# Altium project nrf52805_caaa.PrjPCB
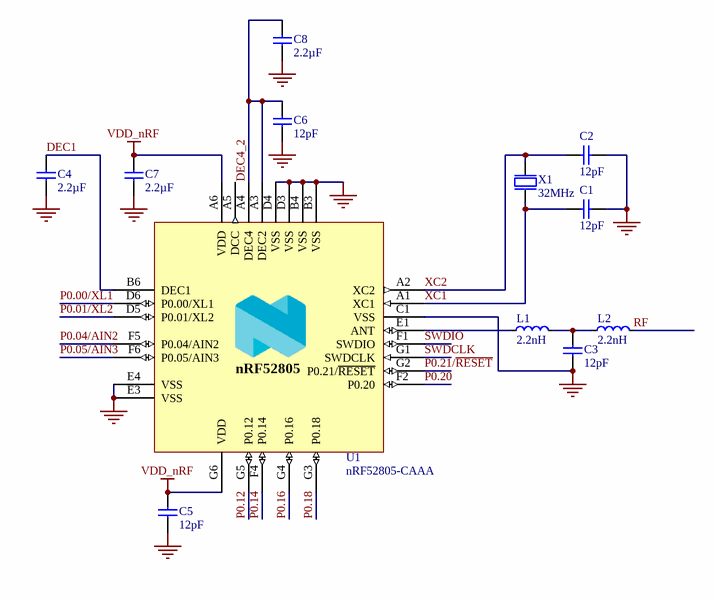
[diagram p0: nrf52805_caaa.SchDoc]
1 sheet, 12 parts. Net scope: global (net labels, ports and power ports of the same name join across sheets).
Board file: PCB1.PcbDoc

## Sheet nrf52805_caaa.SchDoc: nRF52805-CAAA Reference Layout
size A4; Revision: 1.0; SheetNumber: 1; SheetTotal: 1; DrawnBy: RUBR; DocumentSize: A4; PCAName: nRF52805-CAAA Reference Layout

### Parts
C1  12pF  [CAPC0603X03L_C]
C2  12pF  [CAPC0603X03L_C]
C3  12pF  [CAPC0603X03L_C]
C4  2.2µF  [CAPC1005X04L]
C5  12pF  [CAPC0603X03L_C]
C6  12pF  [CAPC0603X03L_C]
C7  2.2µF  [CAPC1005X04L]
C8  2.2µF  [CAPC1005X04L]
L1  2.2nH  [INDC0603X03L_C]
L2  2.2nH  [INDC0603X03L_C]
U1  nRF52805-CAAA  [BGA28C40P6X6_247X246X50]
X1  32MHz  [BT-XTAL_2016]

### Nets
GND: C1.1 C2.1 C3.1 C4.2 C5.2 C6.1 C7.2 C8.1 U1.B3(VSS) U1.B4(VSS) U1.C1(VSS) U1.D3(VSS) U1.D4(VSS) U1.E3(VSS) U1.E4(VSS) X1.2(GND) X1.4(GND)
VDD_nRF: C5.1 C7.1 U1.A6(VDD) U1.G6(VDD)
DEC1: C4.1 U1.B6(DEC1)
DEC4_2: C6.2 C8.2 U1.A3(DEC2) U1.A4(DEC4)
P0.00/XL1: U1.D6(P0.00/XL1)
P0.01/XL2: U1.D5(P0.01/XL2)
P0.04/AIN2: U1.F5(P0.04/AIN2)
P0.05/AIN3: U1.F6(P0.05/AIN3)
P0.12: U1.G5(P0.12)
P0.14: U1.F4(P0.14)
P0.16: U1.G4(P0.16)
P0.18: U1.G3(P0.18)
P0.20: U1.F2(P0.20)
P0.21/~{RESET}: U1.G2(P0.21/~{RESET})
RF: L2.2
SWDCLK: U1.G1(SWDCLK)
SWDIO: U1.F1(SWDIO)
XC1: C1.2 U1.A1(XC1) X1.1(inp)
XC2: C2.2 U1.A2(XC2) X1.3(out)
NetC3_2: C3.2 L1.2 L2.1
NetL1_1: L1.1 U1.E1(ANT)

Not connected (* = marked no-connect by the designer): U1 A5(DCC)

### Notes on the sheet
- Title
- Size
- Date:
- A4
- Project Number
- Sheet         of
- Revision
- File:
- Drawn By:
- (in symbol nRF52805_CAAA) nRF52805

### Library data of the parts
C1 C2 C5 C6 = CAP_0201: Capacitor, NP0, ±2%; Part Number: C0201-12p; Manufacturer: *; Manufacturer Part Number: *; LatestRevisionDate: 2017-11-09; Pin Count: 2; Publisher: Nordic Semiconductor; Published: 2014-11-13; Value: 12pF; Footprint Doc: 0201
C3 = CAP_0201: Capacitor, NP0, ±5%; Part Number: C0201-12p; Manufacturer: *; Manufacturer Part Number: *; LatestRevisionDate: 2017-11-09; Pin Count: 2; Publisher: Nordic Semiconductor; Published: 2014-11-13; Value: 12pF; Footprint Doc: 0201
C4 C7 C8 = CAP_0402: Capacitor, X5R, ±20%; Part Number: C0402-2µ2; Manufacturer: *; Manufacturer Part Number: *; LatestRevisionDate: 2006-06-02; Pin Count: 2; Publisher: Nordic Semiconductor; Published: 2009-05-08; Value: 2.2µF; Footprint Doc: 0402
L1 L2 = IND_0201: High frequency chip inductor ±5%; Part Number: L0201-2n2; Manufacturer: *; Manufacturer Part Number: *; LatestRevisionDate: 2013-04-10; Pin Count: 2; Publisher: Nordic Semiconductor; Published: 2013-04-10; Value: 2.2nH; Footprint Doc: 0201
U1 = nRF52805_CAAA: Multi-protocol Bluetooth Low Energy, IEEE 802.15.4, ANT and 2.4GHz proprietary system-on-chip; Manufacturer: Nordic Semiconductor; Part Number: nRF52805-CAAA; Manufacturer Part Number: nRF52805-CAAA; LatestRevisionDate: 2018-11-28; Pin Count: 28; Publisher: Nordic Semiconductor; Published: 2018-11-28; Value: nRF52805-CAAA; Footprint Doc: WLCSP-28
X1 = XTAL_SMD2016: XTAL SMD 2016, 32MHz, Cl=8pF, Total Tol: ±40ppm; Part Number: XTAL_SMD2016_32MHz_8pF_General; Manufacturer: *; Manufacturer Part Number: *; LatestRevisionDate: 2016-08-19; Pin Count: 4; Publisher: Nordic Semiconductor; Published: 2016-08-19; Value: 32MHz; Footprint Doc: XTAL_2016